# EAGLE design led-controller (EAGLE 8.7.1)
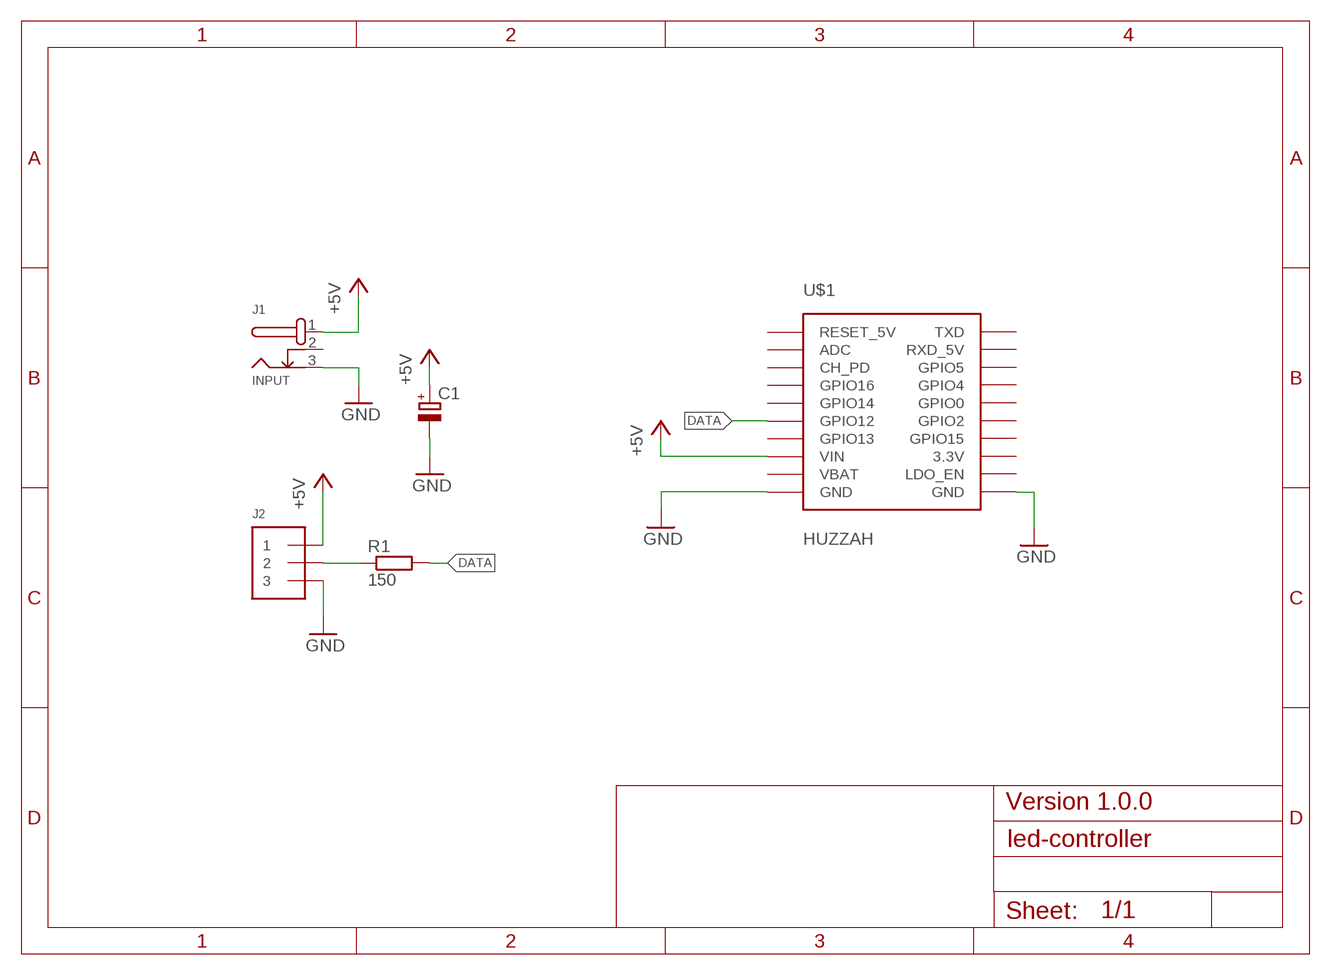
[diagram p0: schematic, sheet 1]

## Parts
C1  CPOL-EUE7.5-16  [E7,5-16]
J1  INPUT  DC10PTH  [DC10]
J2  3,5MM-1X3-TERMBLOCK  [3,5MM-1X3-TERMBLOCK]
R1  150  R-EU_R1206W  [R1206W]
U$1  HUZZAH  [HUZZAH]

## Nets
+5V: C1.+ J1.1 J2.1 U$1.VIN
DATA: R1.2 U$1.GPIO12
DOUT: J2.2 R1.1
GND: C1.- J1.3 J2.3 U$1.GND@1(GND) U$1.GND@2(GND)
Unconnected: U$1.3.3V U$1.ADC U$1.CH_PD U$1.GPIO0 U$1.GPIO2 U$1.GPIO4 U$1.GPIO5 U$1.GPIO13 U$1.GPIO14 U$1.GPIO15 U$1.GPIO16 U$1.LDO_EN U$1.RESET_5V U$1.RXD_5V U$1.TXD*1(TXD) U$1.VBAT

## Notes on the sheet
- Version 1.0.0

## Power pins joined to a net without a drawn wire
2: J1.2

## Library data of the parts
C1 = resistor:CPOL-EU: POLARIZED CAPACITOR, European symbol
J1 = Squarefrog:DC10: Cliff Electronic Components DC-10 <http://www.cliffuk.co.uk/products/dcconnectors/> PCB mounting pin / ring type with switch. Rated 12V / 5A. DC-10A (FC68148) with 2.1mm diameter pin. DC-10B (FC68149) with 2.5mm diameter pin.
J2 = Squarefrog:3,5MM-1X3-TERMBLOCK: 3.5mm Pitch Ultra Low Profile Commercial Screw Terminal Blocks Manufacturer: CamdenBoss <http://camdenboss.com/camblock-plus/pcb-terminal-blocks/3-5mm-pitch/ultra-low-profile-commercial-screw-terminal-block> Part number: CTBP3051/3 Datasheet: ctbp3051_1.pdf <http://camdenboss.com/media/category/files/ctbp3051_1.pdf> Specifications: Ultra low profile 2-12 pole interlocking UL94-V0 flame retardant PA66 Double interlock mechanism for increased strength 0.5-1.0mm2 (24-18AWG) Captive screws Guided pin alignment
R1 = resistor:R-EU_: RESISTOR, European symbol
U$1 = Squarefrog:HUZZAH

## Board
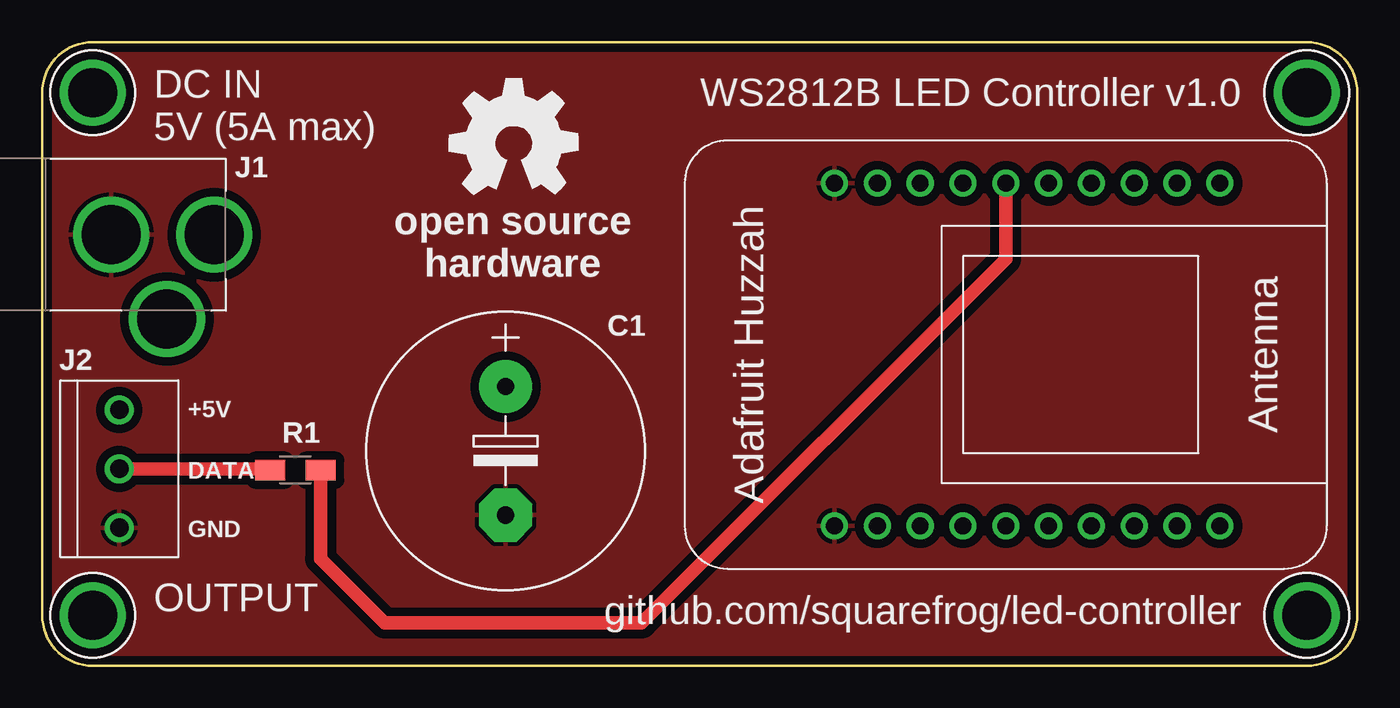
[diagram p1: board, top side]
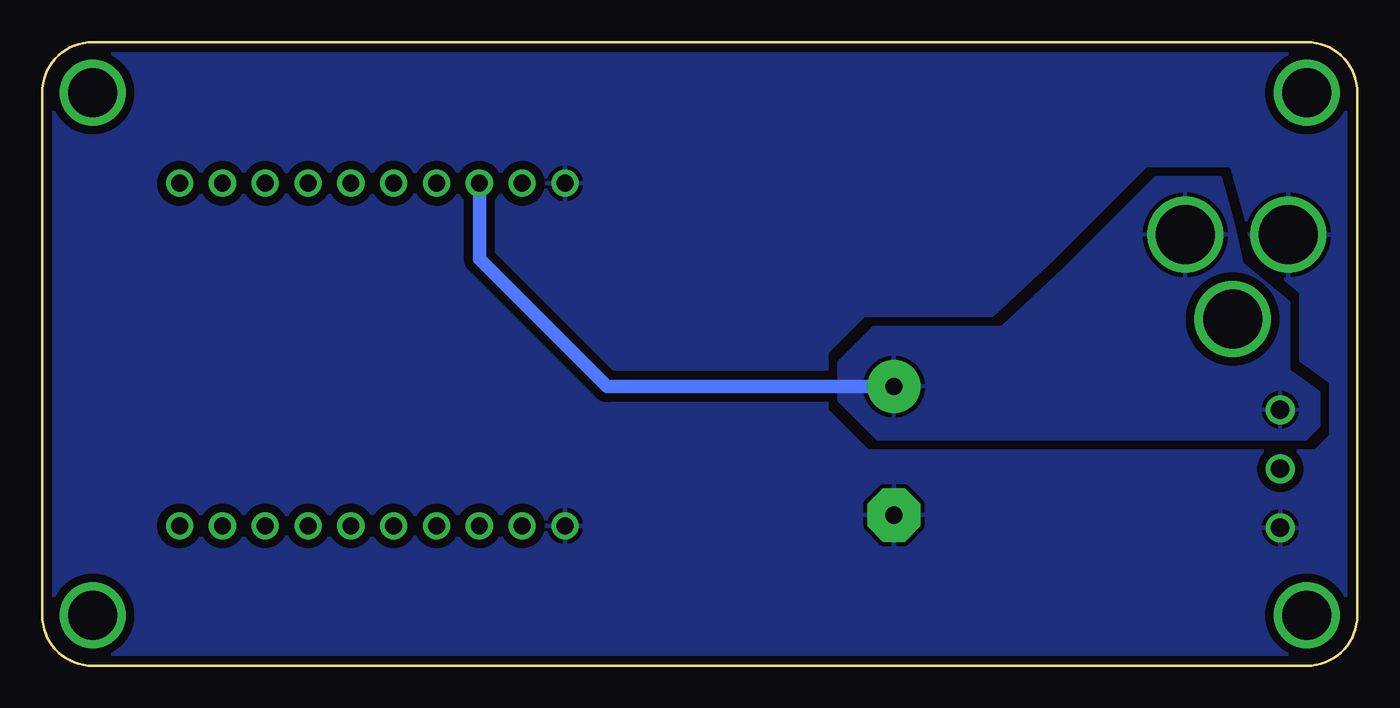
[diagram p2: board, bottom side, seen from below]

Size 78 x 37 mm. Coordinates in mm from the lower left corner, seen from the top.
Outline: 75,0 arc90 78,3 78,34 arc90 75,37 3,37 arc90 0,34 0,3 arc90 3,0 75,0
Copper layers (1*16): Top 0.035mm / dielectric 1.5mm / Bottom 0.035mm
Design rules "SparkFun": minimum track width 8mil, minimum drill 20mil, track to track 8mil, track to pad 8mil, pad to pad 8mil, via to via 8mil, smd to smd 8mil, copper to edge 8mil, drill to drill 8mil, minimum pad ring 12mil, minimum via ring 10mil, stop-mask expansion 4mil, vias tented up to drill 20mil, thermal gap 10mil

### Footprints (pad centres in the part's own frame; a part is rotated, then mirrored left to right if it is on the bottom)
E7,5-16 = drill 1.016 pad 3.15: + -3.81,0 | drill 1.016 pad 3.15 octagon: - 3.81,0
DC10 = drill 3.5: 1 13.5,5; 2 10.7,0; 3 7.4,5
3,5MM-1X3-TERMBLOCK = drill 1.1: 1 -3.5,0; 2 0,0; 3 3.5,0
R1206W = smd 1.8 x 1.2: 1 -1.499,0; 2 1.499,0
HUZZAH = drill 1: 3.3V 22.86,13.97; ADC 2.54,29.21; CH_PD 2.54,26.67; GND@1 2.54,8.89; GND@2 22.86,8.89; GPIO0 22.86,21.59; GPIO2 22.86,19.05; GPIO4 22.86,24.13; GPIO5 22.86,26.67; GPIO12 2.54,19.05; GPIO13 2.54,16.51; GPIO14 2.54,21.59; GPIO15 22.86,16.51; GPIO16 2.54,24.13; LDO_EN 22.86,11.43; RESET_5V 2.54,31.75; RXD_5V 22.86,29.21; TXD*1 22.86,31.75; VBAT 2.54,11.43; VIN 2.54,13.97

### Placement (x,y rotation side)
C1  27.48,12.75 270 top
J1  -3.3,20.57 0 top
J2  4.57,11.68 270 top
R1  15.02,11.61 0 top
U$1  38.1,31.17 270 top
U$2  [OSHW_8MM]  27.94,30.99 0 top

### Tracks (layer width: path | path; a pad name or v marks a point on that pad's centre or on a via)
+5V
  Bottom 0.813: C1.+ 44.5,16.56 52.07,24.13 U$1.VIN
  pour Bottom (isolate 0.508): 8.13,28.96 7.37,26.16 6.86,23.88 4.06,21.59 4.06,17.53 2.29,16.26 2.29,14.22 3.05,13.46 28.45,13.46 30.73,15.75 30.73,18.03 28.7,20.07 21.08,20.07 17.27,23.62 11.94,28.96
DATA
  Top 0.813: R1.2 16.51,11.36 16.51,6.35 20.32,2.54 35.56,2.54 57.15,24.13 U$1.GPIO12
DOUT
  Top 0.152: 13.45,11.68 R1.1
  Top 0.813: J2.2 13.45,11.68
GND
  pour Top (isolate 0.508): 80.01,39.37 80.01,-2.54 -2.54,-2.54 -2.54,39.37
  pour Bottom (isolate 0.508, rank 2): -5.08,43.18 82.55,43.18 82.55,-5.08 -5.08,-5.08
N$1  (via drill 2.9)
  other vias: 3,34
N$2  (via drill 2.9)
  other vias: 3,3
N$3  (via drill 2.9)
  other vias: 75,34
N$5  (via drill 2.9)
  other vias: 75,3

### Text on the board
tPlace: WS2812B LED Controller v1.0 | DC IN / 5V (5A max) | J1 | C1 | J2 | +5V | R1 | DATA | GND | OUTPUT | github.com/squarefrog/led-controller